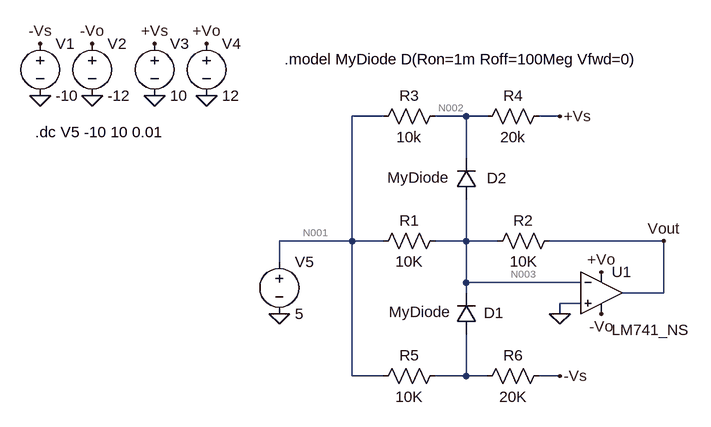
[diagram p0: schematic lab3_2.asc]
* lab3_2.asc
R1 N003 N001 10K
R2 Vout N003 10K
R3 N002 N001 10k
R4 +Vs N002 20k
R5 N004 N001 10K
R6 -Vs N004 20K
D1 N004 N003 MyDiode
D2 N003 N002 MyDiode
* U1: LM741_NS (symbol AutoGenerated\LM741_NS not available, pins judged from their places): In+=0 In-=N003 V+=+Vo V-=-Vo OUT=Vout
V1 -Vs 0 -10
V2 -Vo 0 -12
V3 +Vs 0 10
V4 +Vo 0 12
V5 N001 0 5
.model D D
.lib standard.dio
.model MyDiode D(Ron=1m Roff=100Meg Vfwd=0)
.dc V5 -10 10 0.01
.backanno
.end

* Results of the author's LTspice run, read from the files saved beside the schematic
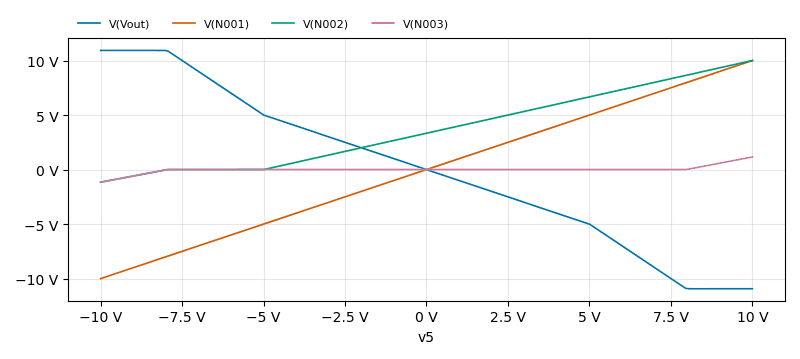
[diagram p1: DC transfer characteristic of lab3_2.asc, plotted from the saved traces]
* DC transfer characteristic, 1 run:
*   V(Vout): 10.93 V at v5=-10 V, -10.93 V at v5=10 V, min -10.93 V, max 10.93 V
*   V(N001): -10 V at v5=-10 V, 10 V at v5=10 V, min -10 V, max 10 V
*   V(N002): -1.157 V at v5=-10 V, 9.999 V at v5=10 V, min -1.157 V, max 9.999 V
*   V(N003): -1.157 V at v5=-10 V, 1.157 V at v5=10 V, min -1.157 V, max 1.157 V